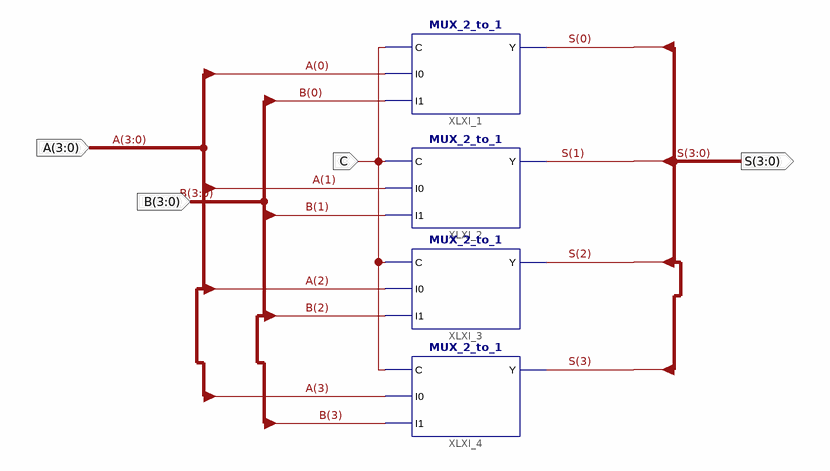
[diagram p0: schematic sheet 1]
// Xilinx ISE schematic Mux_2Way_4Bit.sch (spartan3e) as structural Verilog: 4 symbols, 4 ports
module Mux_2Way_4Bit (
  input  C,
  input  [3:0] B,
  input  [3:0] A,
  output [3:0] S
);

  MUX_2_to_1 XLXI_1 (.C(C), .I0(A[0]), .I1(B[0]), .Y(S[0]));
  MUX_2_to_1 XLXI_2 (.C(C), .I0(A[1]), .I1(B[1]), .Y(S[1]));
  MUX_2_to_1 XLXI_3 (.C(C), .I0(A[2]), .I1(B[2]), .Y(S[2]));
  MUX_2_to_1 XLXI_4 (.C(C), .I0(A[3]), .I1(B[3]), .Y(S[3]));
endmodule
